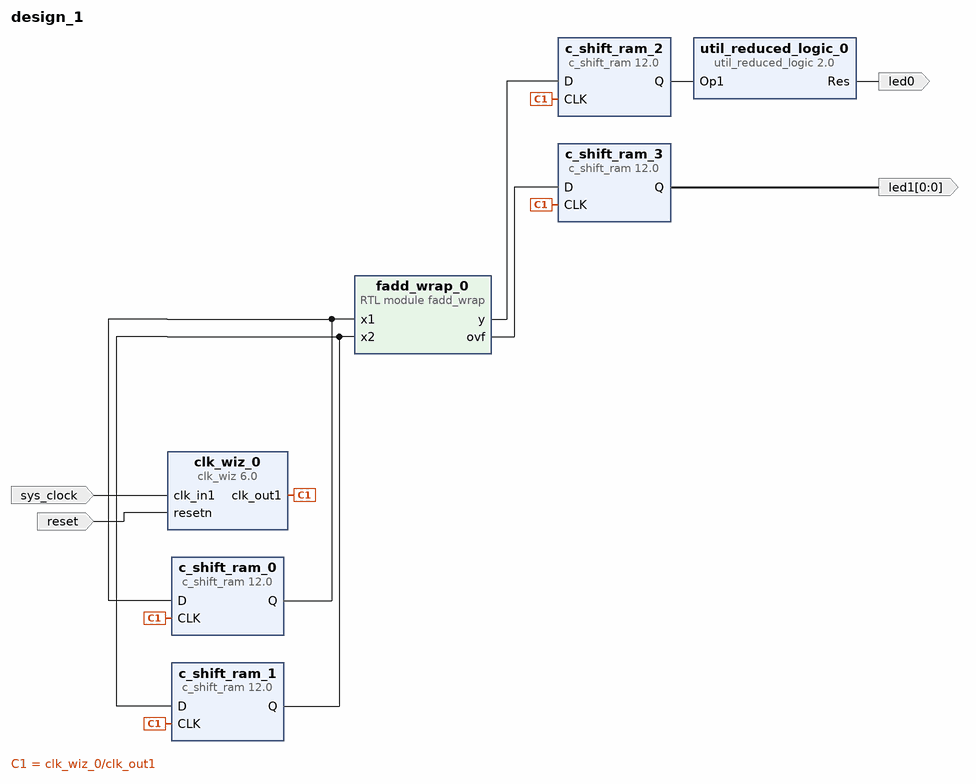
[diagram p0: block diagram of the top level]
# Vivado block design design_1, xc7a35ticsg324-1L, Vivado 2020.2
create_bd_design design_1

create_bd_port -dir O -type data led0
create_bd_port -dir O -from 0 -to 0 -type data led1
create_bd_port -dir I -type clk sys_clock
set_property -dict {CONFIG.FREQ_HZ 100000000 CONFIG.PHASE 0.000} [get_bd_ports sys_clock]
create_bd_port -dir I -type rst reset
set_property -dict {CONFIG.POLARITY ACTIVE_LOW} [get_bd_ports reset]

create_bd_cell -type ip -vlnv xilinx.com:ip:util_reduced_logic:2.0 util_reduced_logic_0
set_property -dict {CONFIG.C_OPERATION xor CONFIG.C_SIZE 32} [get_bd_cells util_reduced_logic_0]
create_bd_cell -type ip -vlnv xilinx.com:ip:c_shift_ram:12.0 c_shift_ram_0
set_property -dict [list \
  CONFIG.AsyncInitVal 00000000000000000000000000000000 \
  CONFIG.DefaultData 00000000000000000000000000000000 \
  CONFIG.Depth 1 \
  CONFIG.Width 32 \
] [get_bd_cells c_shift_ram_0]
create_bd_cell -type ip -vlnv xilinx.com:ip:c_shift_ram:12.0 c_shift_ram_1
set_property -dict [list \
  CONFIG.AsyncInitVal 00000000000000000000000000000000 \
  CONFIG.DefaultData 00000000000000000000000000000000 \
  CONFIG.Depth 1 \
  CONFIG.Width 32 \
] [get_bd_cells c_shift_ram_1]
create_bd_cell -type ip -vlnv xilinx.com:ip:c_shift_ram:12.0 c_shift_ram_2
set_property -dict [list \
  CONFIG.AsyncInitVal 00000000000000000000000000000000 \
  CONFIG.DefaultData 00000000000000000000000000000000 \
  CONFIG.Depth 1 \
  CONFIG.Width 32 \
] [get_bd_cells c_shift_ram_2]
create_bd_cell -type ip -vlnv xilinx.com:ip:c_shift_ram:12.0 c_shift_ram_3
set_property -dict {CONFIG.AsyncInitVal 0 CONFIG.DefaultData 0 CONFIG.Depth 1 CONFIG.Width 1} [get_bd_cells c_shift_ram_3]
create_bd_cell -type ip -vlnv xilinx.com:ip:clk_wiz:6.0 clk_wiz_0
set_property -dict [list \
  CONFIG.CLK_IN1_BOARD_INTERFACE sys_clock \
  CONFIG.RESET_BOARD_INTERFACE reset \
  CONFIG.RESET_PORT resetn \
  CONFIG.RESET_TYPE ACTIVE_LOW \
  CONFIG.USE_BOARD_FLOW true \
] [get_bd_cells clk_wiz_0]
create_bd_cell -type module -reference fadd_wrap fadd_wrap_0

# ---- connections ----

connect_bd_net -net c_shift_ram_0_Q [get_bd_pins c_shift_ram_0/Q] [get_bd_pins c_shift_ram_0/D] [get_bd_pins fadd_wrap_0/x1]
connect_bd_net -net c_shift_ram_1_Q [get_bd_pins c_shift_ram_1/Q] [get_bd_pins c_shift_ram_1/D] [get_bd_pins fadd_wrap_0/x2]
connect_bd_net -net fadd_wrap_0_y [get_bd_pins fadd_wrap_0/y] [get_bd_pins c_shift_ram_2/D]
connect_bd_net -net fadd_wrap_0_ovf [get_bd_pins fadd_wrap_0/ovf] [get_bd_pins c_shift_ram_3/D]
connect_bd_net [get_bd_pins c_shift_ram_2/Q] [get_bd_pins util_reduced_logic_0/Op1]
connect_bd_net [get_bd_pins util_reduced_logic_0/Res] [get_bd_ports led0]
connect_bd_net [get_bd_pins c_shift_ram_3/Q] [get_bd_ports led1]
connect_bd_net [get_bd_ports sys_clock] [get_bd_pins clk_wiz_0/clk_in1]
connect_bd_net [get_bd_pins clk_wiz_0/clk_out1] \
  [get_bd_pins c_shift_ram_0/CLK] [get_bd_pins c_shift_ram_1/CLK] [get_bd_pins c_shift_ram_2/CLK] \
  [get_bd_pins c_shift_ram_3/CLK]
connect_bd_net [get_bd_ports reset] [get_bd_pins clk_wiz_0/resetn]
set_property HDL_ATTRIBUTE.DEBUG true [get_bd_nets c_shift_ram_0_Q]
set_property HDL_ATTRIBUTE.MARK_DEBUG true [get_bd_nets c_shift_ram_0_Q]
set_property HDL_ATTRIBUTE.DEBUG true [get_bd_nets c_shift_ram_1_Q]
set_property HDL_ATTRIBUTE.MARK_DEBUG true [get_bd_nets c_shift_ram_1_Q]
set_property HDL_ATTRIBUTE.DEBUG true [get_bd_nets fadd_wrap_0_y]
set_property HDL_ATTRIBUTE.MARK_DEBUG true [get_bd_nets fadd_wrap_0_y]
set_property HDL_ATTRIBUTE.DEBUG true [get_bd_nets fadd_wrap_0_ovf]
set_property HDL_ATTRIBUTE.MARK_DEBUG true [get_bd_nets fadd_wrap_0_ovf]

validate_bd_design
save_bd_design
